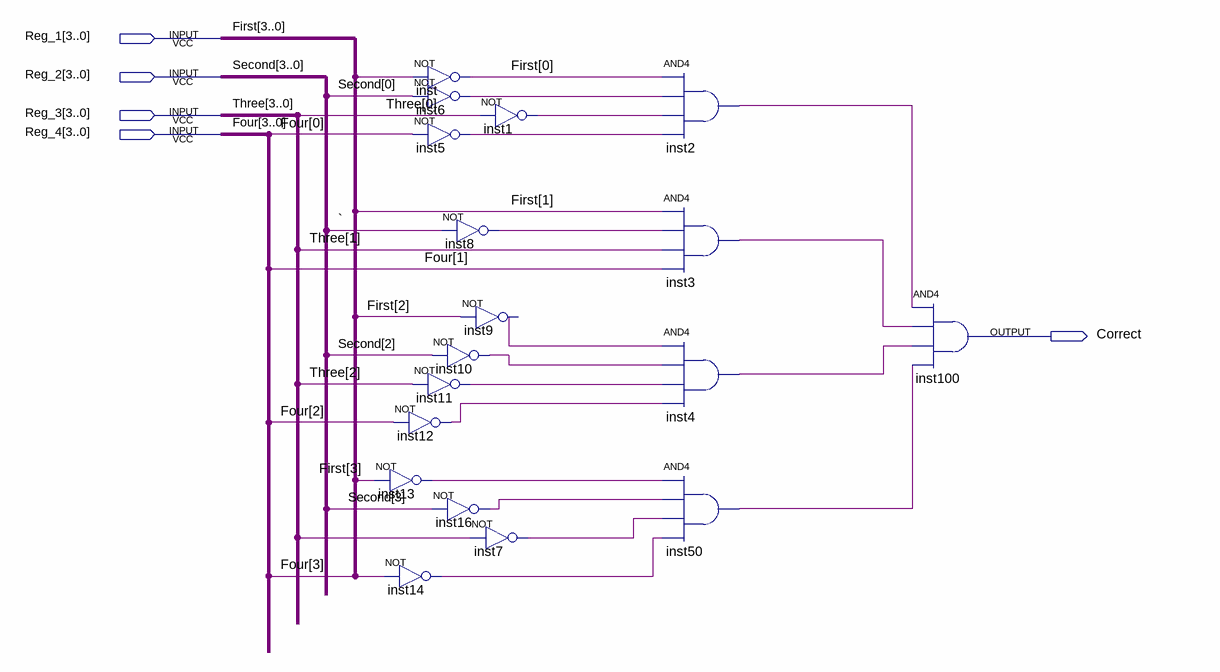
[diagram p0: schematic sheet]
// Quartus schematic ji.bdf as structural Verilog: 18 symbols, 5 pins
module ji (
  input  [3:0] Reg_1,
  input  [3:0] Reg_2,
  input  [3:0] Reg_3,
  input  [3:0] Reg_4,
  output Correct
);

  wire \` , inst1_out, inst2_out, inst3_out, inst4_out, inst5_out, inst6_out, inst7_out, inst8_out,
       inst9_out, inst10_out, inst11_out, inst12_out, inst13_out, inst14_out, inst16_out, inst50_out,
       undriven, undriven_2;

  not inst12 (inst12_out, Reg_4[2]);
  not inst13 (inst13_out, Reg_1[3]);
  not inst14 (inst14_out, Reg_4[3]);
  not inst (Reg_1[0], undriven_2);
  not inst6 (inst6_out, Reg_2[0]);
  not inst5 (inst5_out, Reg_4[0]);
  not inst8 (inst8_out, \` );
  not inst9 (inst9_out, Reg_1[2]);
  not inst10 (inst10_out, Reg_2[2]);
  not inst11 (inst11_out, Reg_3[2]);
  not inst16 (inst16_out, Reg_2[3]);
  not inst7 (inst7_out, undriven);
  not inst1 (inst1_out, Reg_3[0]);
  and inst2 (inst2_out, Reg_1[0], inst6_out, inst1_out, inst5_out);
  and inst3 (inst3_out, Reg_1[1], inst8_out, Reg_3[1], Reg_4[1]);
  and inst4 (inst4_out, inst9_out, inst10_out, inst11_out, inst12_out);
  and inst50 (inst50_out, inst13_out, inst16_out, inst7_out, inst14_out);
  and inst100 (Correct, inst2_out, inst3_out, inst4_out, inst50_out);

  // Other names for the same wires on the sheet: First[3:0] = Reg_1; Four[3:0] = Reg_4; Second[3:0] = Reg_2;
  //   Three[3:0] = Reg_3
endmodule
